# Altium schematic sheet JTAG adapter.SchDoc
size A4
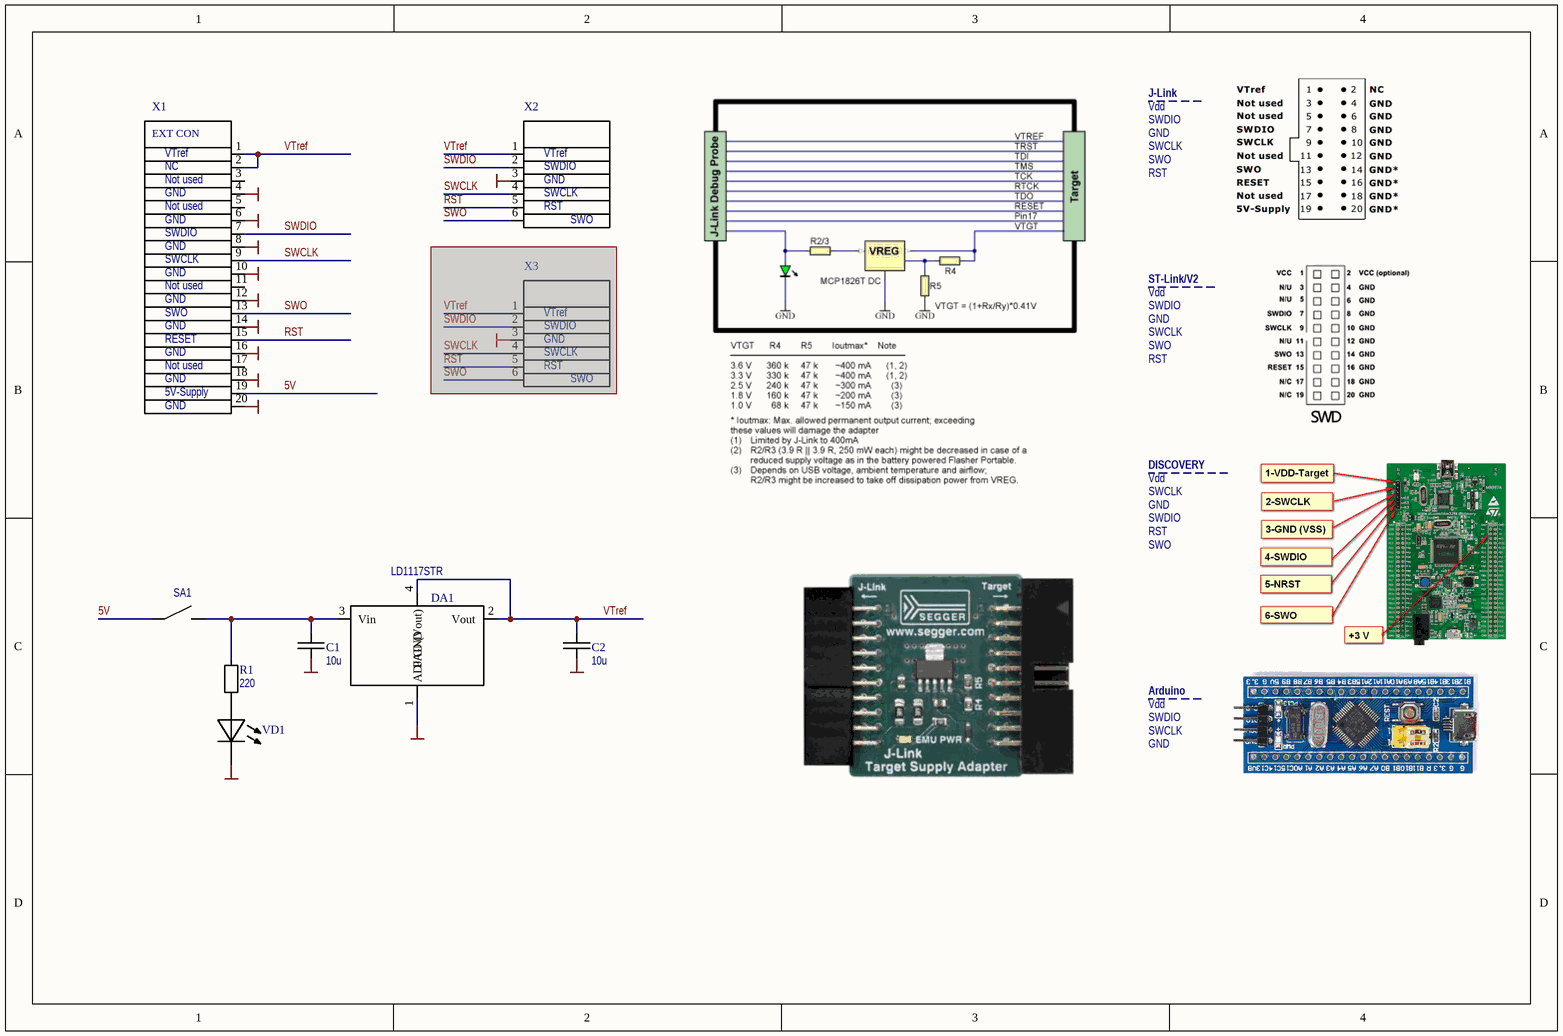
[diagram p0: JTAG adapter.SchDoc]

## Parts
C1  10u  [MLCC-CC0805]
C2  10u  [MLCC-CC0805]
DA1  (no value)  [ON SEMI SOT-223 ST(318H)]
R1  220  [R0603]
SA1  DS1040-01RT  [DS1040-01RT]  (value not drawn)
VD1  BL-LS0603UHR  [LED R0603 RED]  (value not drawn)
X1  Connector-20  [IDC-20F-EDGE]  (value not drawn)
X2  Connector-6  [BH-6]  (value not drawn)
X3  Connector-6  [PLS-6R]  (value not drawn)  (masked out: inside a compile mask, not in the netlist)

## Nets
GND: C1.2 C2.2 DA1.1(ADJ/GND) VD1.1(C) X1.4 X1.6 X1.8 X1.10 X1.12 X1.14 X1.16 X1.18 X1.20 X2.3
5V: SA1.1 X1.19
RST: X1.15 X2.5
SWCLK: X1.9 X2.4
SWDIO: X1.7 X2.2
SWO: X1.13 X2.6
VTref: C2.1 DA1.2(Vout) DA1.4(PAD_(Vout)) X1.1 X1.2 X2.1
NetC1_1: C1.1 DA1.3(Vin) R1.2 SA1.2
NetR1_1: R1.1 VD1.2(A)

Not connected (* = marked no-connect by the designer): X1 3 5 11 17

## Notes on the sheet
- J-Link
- Vdd
- (near X1) VTref
- NC
- (near X1) Not used
- (near X2) VTref
- (near X2) SWDIO
- (near X2) GND
- SWDIO
- GND
- SWCLK
- RST
- SWO
- (near X1) GND
- (near X1) SWDIO
- (near X2) SWCLK
- (near X2) RST
- (near X2) SWO
- (near X1) SWCLK
- (near X1) SWO
- (near X3) VTref
- ST-Link/V2
- (near X1) RESET
- (near X3) SWDIO
- (near X3) GND
- (near X3) SWCLK
- (near X3) RST
- (near X3) SWO
- (near X1) 5V-Supply
- DISCOVERY
- Arduino
- (in symbol SFH11-XXXC-D10-RA-BK) EXT CON

## Library data of the parts
C1 C2 = CC0805 10uF 10V X5R 10%: Part Number: GRM21BR61A106KE19L; Vendor: TDK; Component Name: CC0805 10uF 10V X5R 10%; HelpURL: https://product.tdk.com/en/search/capacitor/ceramic/mlcc/list#pn=C2012X5R1A106K&_l=20&_p=1&_c=part_no-part_no&_d=0; Pins: 2; Package: CC0805; Price: 0.002; Value: 10u
DA1 = LD1117STR: LDO ADJ 0.8mA; Vendor: ON; Component Name: LD1117STR; Part Number: LD1117STR; HelpURL: https://www.chipdip.ru/product/ld1117str-2; Pins: 4; Package: SOT-223
R1 = R0603 220 1%: 1/10W 75V; Part Number: CR-03FL5--220R; Vendor: Viking; Component Name: R0603 220 1%; HelpURL: http://www.vikingamerica.com/ftp/CR.pdf; Pins: 2; Package: R0603; Price: 0.0009; Value: 220; Power: 1/10W
SA1 = DS1040-01RT: Vendor: Connfly; Component Name: DS1040-01RT; Part Number: DS1040-01RT; HelpURL: https://www.chipdip.ru/product/ds1040-01rt; Pins: 2; Value: DS1040-01RT
VD1 = BL-LS0603UHR: LER 0603 Red; Value: 20mA; Component Name: BL-LS0603UHR; Part Number: BL-LS0603UHR; HelpURL: https://www.chipdip.ru/product/bl-ls0603uhr; Pins: 2; Package: LED 0603
X1 = SFH11-XXXC-D10-RA-BK: 2x10, 2.54mm pitch, 90 angle, female with key; Component Name: SFH11-XXXC-D10-RA-BK; Part Number: SFH11-XXXC-D10-RA-BK; Pins: 20
X2 = BH-6: 2.54mm pitch, 6pin with housing; Component Name: BH-6; Part Number: BH-6; Pins: 6
X3 = PLS-6R: 2.54mm pitch, 6pin; Component Name: PLS-6R; Part Number: PLS-6R; Pins: 6